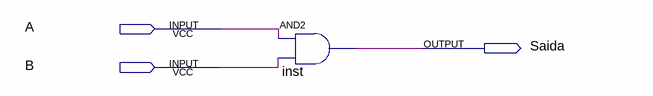
[diagram p0: schematic sheet]
// Quartus schematic Introducao_FPGA_And.bdf as structural Verilog: 1 symbols, 3 pins
module Introducao_FPGA_And (
  input  A,
  input  B,
  output Saida
);

  and inst (Saida, A, B);
endmodule
